# Altium schematic sheet RELAY13.SchDoc
size A
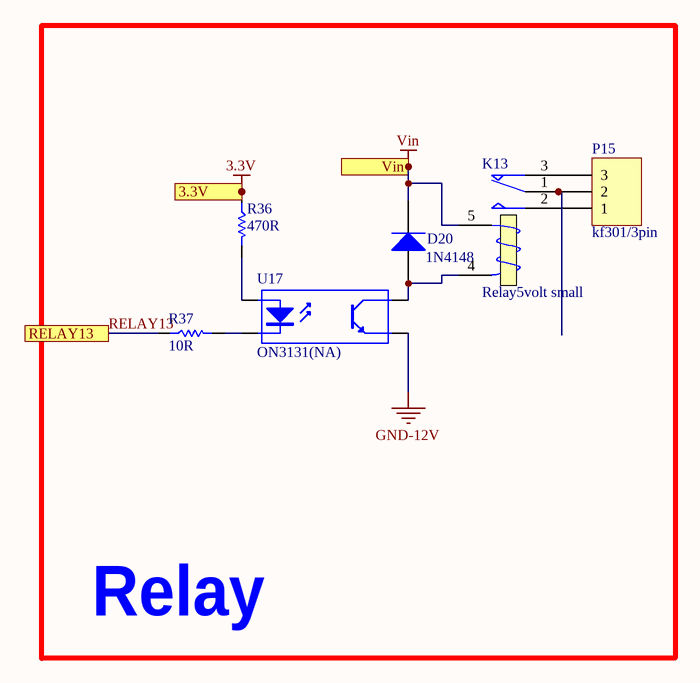
[diagram p0: RELAY13.SchDoc]

## Parts
D20  1N4148  [sod123]
K13  Relay5volt small  [relay5_childern]
P15  kf301/3pin  [Blue Connector 1*3 -kf301]
R36  470R  [0805/resistor]
R37  10R  [0805/resistor]
U17  ON3131(NA)  [OPTO_COUPLER]

## Blocks framed on the sheet
Relay: D20 K13 P15 R36 R37 U17

## Ports
3.3V, RELAY13, Vin

## Nets
3.3V: R36.1 ; port 3.3V
GND-12V: U17.3(E)
Vin: D20.K K13.5 ; port Vin
RELAY13: R37.1 ; port RELAY13
NetD20_A: D20.A K13.4(T2) U17.4(C)
NetK13_1: K13.1(COM) P15.2
NetK13_2: K13.2(NO) P15.1
NetK13_3: K13.3(T1) P15.3
NetR36_2: R36.2 U17.1(A)
NetR37_2: R37.2 U17.2(K)

## Library data of the parts
D20 = Diode 1N4007: 1 Amp General Purpose Rectifier; Published: 8-Jun-2000; LatestRevisionDate: 17-Jul-2002; LatestRevisionNote: Re-released for DXP Platform.; DatasheetVersion: 1998; PackageVersion: Aug-1999; PackageReference: DO-41; Publisher: Altium Limited; PackageDescription: Diode, Axial; Body 5.2 x 2.7 mm (LxDia. max), Lead Dia. 0.86 mm (max); Code_JEDEC: DO-204-AL; ComponentLink1Description: Manufacturer Link; ComponentLink1URL: http://www.fairchildsemi.com/; ComponentLink2Description: Datasheet; ComponentLink2URL: http://www.fairchildsemi.com/ds/1N%2F1N4001.pdf
K13 = Relay: SPDT Relay; Published: 8-Jun-2000; LatestRevisionDate: 17-Jul-2002; LatestRevisionNote: Re-released for DXP Platform.; PackageReference: MODULE5B; Publisher: Altium Limited
P15 = Header 3: LatestRevisionDate: 17-Jul-2002; LatestRevisionNote: Re-released for DXP Platform.; Publisher: Altium Limited
R36 R37 = Resistor: Tolerance: 5%; Power: 1/8 W
  R36: Value: 470R
  R37: Value: 10R
U17 = Optoisolator1: 4-Pin Phototransistor Optocoupler; Published: 24-Mar-1999; LatestRevisionDate: 04-Mar-2005; LatestRevisionNote: Sch pins 3 & 4 Swapped.; DatasheetVersion: Nov-2003; PackageReference: DIP-4; Publisher: Altium Limited